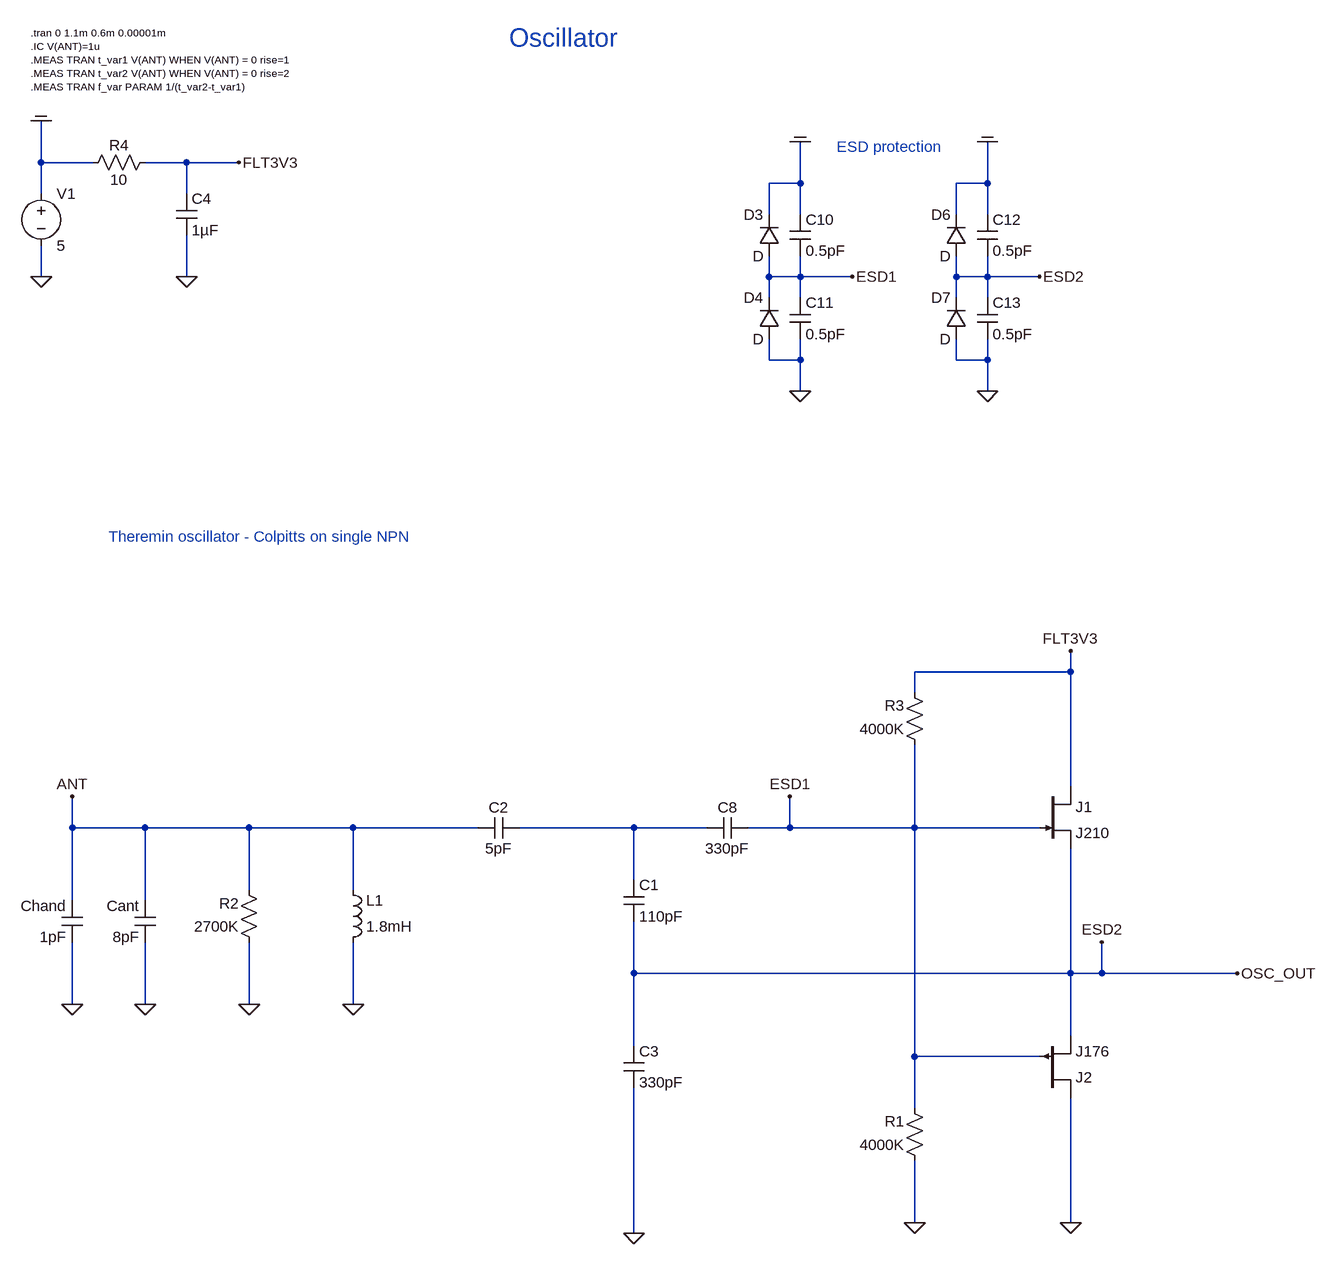
[diagram p0: schematic 2020_nmos_osc_v3.asc]
2020_nmos_osc_v3.asc, the LTspice schematic file:
Version 4
SHEET 1 2908 2724
WIRE -1056 -336 -1056 -400
WIRE -976 -336 -1056 -336
WIRE -832 -336 -896 -336
WIRE -752 -336 -832 -336
WIRE 112 -304 112 -368
WIRE 112 -304 64 -304
WIRE 400 -304 400 -368
WIRE 400 -304 352 -304
WIRE -1056 -288 -1056 -336
WIRE -832 -288 -832 -336
WIRE 64 -256 64 -304
WIRE 112 -256 112 -304
WIRE 352 -256 352 -304
WIRE 400 -256 400 -304
WIRE -1056 -160 -1056 -208
WIRE -832 -160 -832 -224
WIRE 64 -160 64 -192
WIRE 112 -160 112 -192
WIRE 112 -160 64 -160
WIRE 192 -160 112 -160
WIRE 352 -160 352 -192
WIRE 400 -160 400 -192
WIRE 400 -160 352 -160
WIRE 480 -160 400 -160
WIRE 64 -128 64 -160
WIRE 112 -128 112 -160
WIRE 352 -128 352 -160
WIRE 400 -128 400 -160
WIRE 64 -32 64 -64
WIRE 112 -32 112 -64
WIRE 112 -32 64 -32
WIRE 352 -32 352 -64
WIRE 400 -32 400 -64
WIRE 400 -32 352 -32
WIRE 112 16 112 -32
WIRE 400 16 400 -32
WIRE 528 448 528 416
WIRE 528 448 288 448
WIRE 288 480 288 448
WIRE 528 624 528 448
WIRE -1008 688 -1008 640
WIRE -896 688 -1008 688
WIRE -736 688 -896 688
WIRE -576 688 -736 688
WIRE -384 688 -576 688
WIRE -144 688 -320 688
WIRE -32 688 -144 688
WIRE 96 688 96 640
WIRE 96 688 32 688
WIRE 288 688 288 560
WIRE 288 688 96 688
WIRE 480 688 288 688
WIRE -144 768 -144 688
WIRE -736 784 -736 688
WIRE -576 784 -576 688
WIRE -1008 800 -1008 688
WIRE -896 800 -896 688
WIRE -144 912 -144 832
WIRE 528 912 528 720
WIRE 528 912 -144 912
WIRE 576 912 576 864
WIRE 576 912 528 912
WIRE 784 912 576 912
WIRE -1008 960 -1008 864
WIRE -896 960 -896 864
WIRE -736 960 -736 864
WIRE -576 960 -576 864
WIRE 528 1008 528 912
WIRE -144 1024 -144 912
WIRE 288 1040 288 688
WIRE 480 1040 288 1040
WIRE 288 1120 288 1040
WIRE 288 1296 288 1200
WIRE 528 1296 528 1104
WIRE -144 1312 -144 1088
FLAG -1056 -160 0
FLAG -1008 960 0
FLAG -1008 640 ANT
FLAG -1056 -400 COM
FLAG 112 16 0
FLAG 112 -368 COM
FLAG 192 -160 ESD1
FLAG 400 16 0
FLAG 400 -368 COM
FLAG 480 -160 ESD2
FLAG -896 960 0
FLAG 96 640 ESD1
FLAG -832 -160 0
FLAG -736 960 0
FLAG -576 960 0
FLAG -752 -336 FLT3V3
FLAG 528 416 FLT3V3
FLAG 784 912 OSC_OUT
FLAG -144 1312 0
FLAG 288 1296 0
FLAG 576 864 ESD2
FLAG 528 1296 0
SYMBOL voltage -1056 -304 R0
WINDOW 123 0 0 Left 2
WINDOW 39 0 0 Left 2
SYMATTR InstName V1
SYMATTR Value 5
SYMBOL ind -592 880 M180
WINDOW 0 36 80 Left 2
WINDOW 3 36 40 Left 2
SYMATTR InstName L1
SYMATTR Value 1.8mH
SYMATTR SpiceLine Ipk=0.1 Rser=50 Rpar=20Meg Cpar=1.286pF
SYMBOL cap -992 800 M0
SYMATTR InstName Chand
SYMATTR Value 1pF
SYMBOL diode 80 -192 R180
WINDOW 0 24 64 Left 2
WINDOW 3 24 0 Left 2
SYMATTR InstName D3
SYMBOL diode 80 -64 R180
WINDOW 0 24 64 Left 2
WINDOW 3 24 0 Left 2
SYMATTR InstName D4
SYMBOL cap 96 -256 R0
SYMATTR InstName C10
SYMATTR Value 0.5pF
SYMBOL cap 96 -128 R0
SYMATTR InstName C11
SYMATTR Value 0.5pF
SYMBOL diode 368 -192 R180
WINDOW 0 24 64 Left 2
WINDOW 3 24 0 Left 2
SYMATTR InstName D6
SYMBOL diode 368 -64 R180
WINDOW 0 24 64 Left 2
WINDOW 3 24 0 Left 2
SYMATTR InstName D7
SYMBOL cap 384 -256 R0
SYMATTR InstName C12
SYMATTR Value 0.5pF
SYMBOL cap 384 -128 R0
SYMATTR InstName C13
SYMATTR Value 0.5pF
SYMBOL cap -880 800 M0
SYMATTR InstName Cant
SYMATTR Value 8pF
SYMBOL res -880 -352 R90
WINDOW 0 5 56 VBottom 2
WINDOW 3 27 56 VTop 2
SYMATTR InstName R4
SYMATTR Value 10
SYMBOL cap -848 -288 R0
SYMATTR InstName C4
SYMATTR Value 1µF
SYMBOL res 304 1216 R180
WINDOW 0 31 76 Left 2
WINDOW 3 31 40 Left 2
SYMATTR InstName R1
SYMATTR Value 4000K
SYMBOL res -720 880 R180
WINDOW 0 31 76 Left 2
WINDOW 3 31 40 Left 2
SYMATTR InstName R2
SYMATTR Value 2700K
SYMBOL cap -160 768 R0
SYMATTR InstName C1
SYMATTR Value 110pF
SYMBOL cap -160 1024 R0
SYMATTR InstName C3
SYMATTR Value 330pF
SYMBOL cap 32 672 R90
WINDOW 0 0 32 VBottom 2
WINDOW 3 32 32 VTop 2
SYMATTR InstName C8
SYMATTR Value 330pF
SYMBOL cap -320 672 R90
WINDOW 0 0 32 VBottom 2
WINDOW 3 32 32 VTop 2
SYMATTR InstName C2
SYMATTR Value 5pF
SYMBOL res 304 576 R180
WINDOW 0 31 76 Left 2
WINDOW 3 31 40 Left 2
SYMATTR InstName R3
SYMATTR Value 4000K
SYMBOL njf 480 624 R0
SYMATTR InstName J1
SYMATTR Value J210
SYMBOL pjf 480 1104 M180
SYMATTR InstName J2
SYMATTR Value J176
TEXT -1072 -536 Left 1 !.tran 0 1.1m 0.6m 0.00001m\n.IC V(ANT)=1u\n.MEAS TRAN t_var1 V(ANT) WHEN V(ANT) = 0 rise=1\n.MEAS TRAN t_var2 V(ANT) WHEN V(ANT) = 0 rise=2\n.MEAS TRAN f_var PARAM 1/(t_var2-t_var1)
TEXT 168 -360 Left 2 ;ESD protection
TEXT -336 -528 Left 4 ;Oscillator
TEXT -952 240 Left 2 ;Theremin oscillator - Colpitts on single NPN

The netlist it stands for:
* 2020_nmos_osc_v3.asc
V1 COM 0 5
L1 0 ANT 1.8mH Ipk=0.1 Rser=50 Rpar=20Meg Cpar=1.286pF
Chand ANT 0 1pF
D3 ESD1 COM D
D4 0 ESD1 D
C10 COM ESD1 0.5pF
C11 ESD1 0 0.5pF
D6 OSC_OUT COM D
D7 0 OSC_OUT D
C12 COM OSC_OUT 0.5pF
C13 OSC_OUT 0 0.5pF
Cant ANT 0 8pF
R4 FLT3V3 COM 10
C4 FLT3V3 0 1µF
R1 0 ESD1 4000K
R2 0 ANT 2700K
C1 N001 OSC_OUT 110pF
C3 OSC_OUT 0 330pF
C8 ESD1 N001 330pF
C2 N001 ANT 5pF
R3 ESD1 FLT3V3 4000K
J1 FLT3V3 ESD1 OSC_OUT J210
J2 0 ESD1 OSC_OUT J176
.model D D
.lib standard.dio
.model NJF NJF
.model PJF PJF
.lib standard.jft
.tran 0 1.1m 0.6m 0.00001m
.IC V(ANT)=1u
.MEAS TRAN t_var1 V(ANT) WHEN V(ANT) = 0 rise=1
.MEAS TRAN t_var2 V(ANT) WHEN V(ANT) = 0 rise=2
.MEAS TRAN f_var PARAM 1/(t_var2-t_var1)
* ESD protection
* Oscillator
* Theremin oscillator - Colpitts on single NPN
.backanno
.end